# EAGLE design VF_OrdRes_PCB (EAGLE 9.6.2)
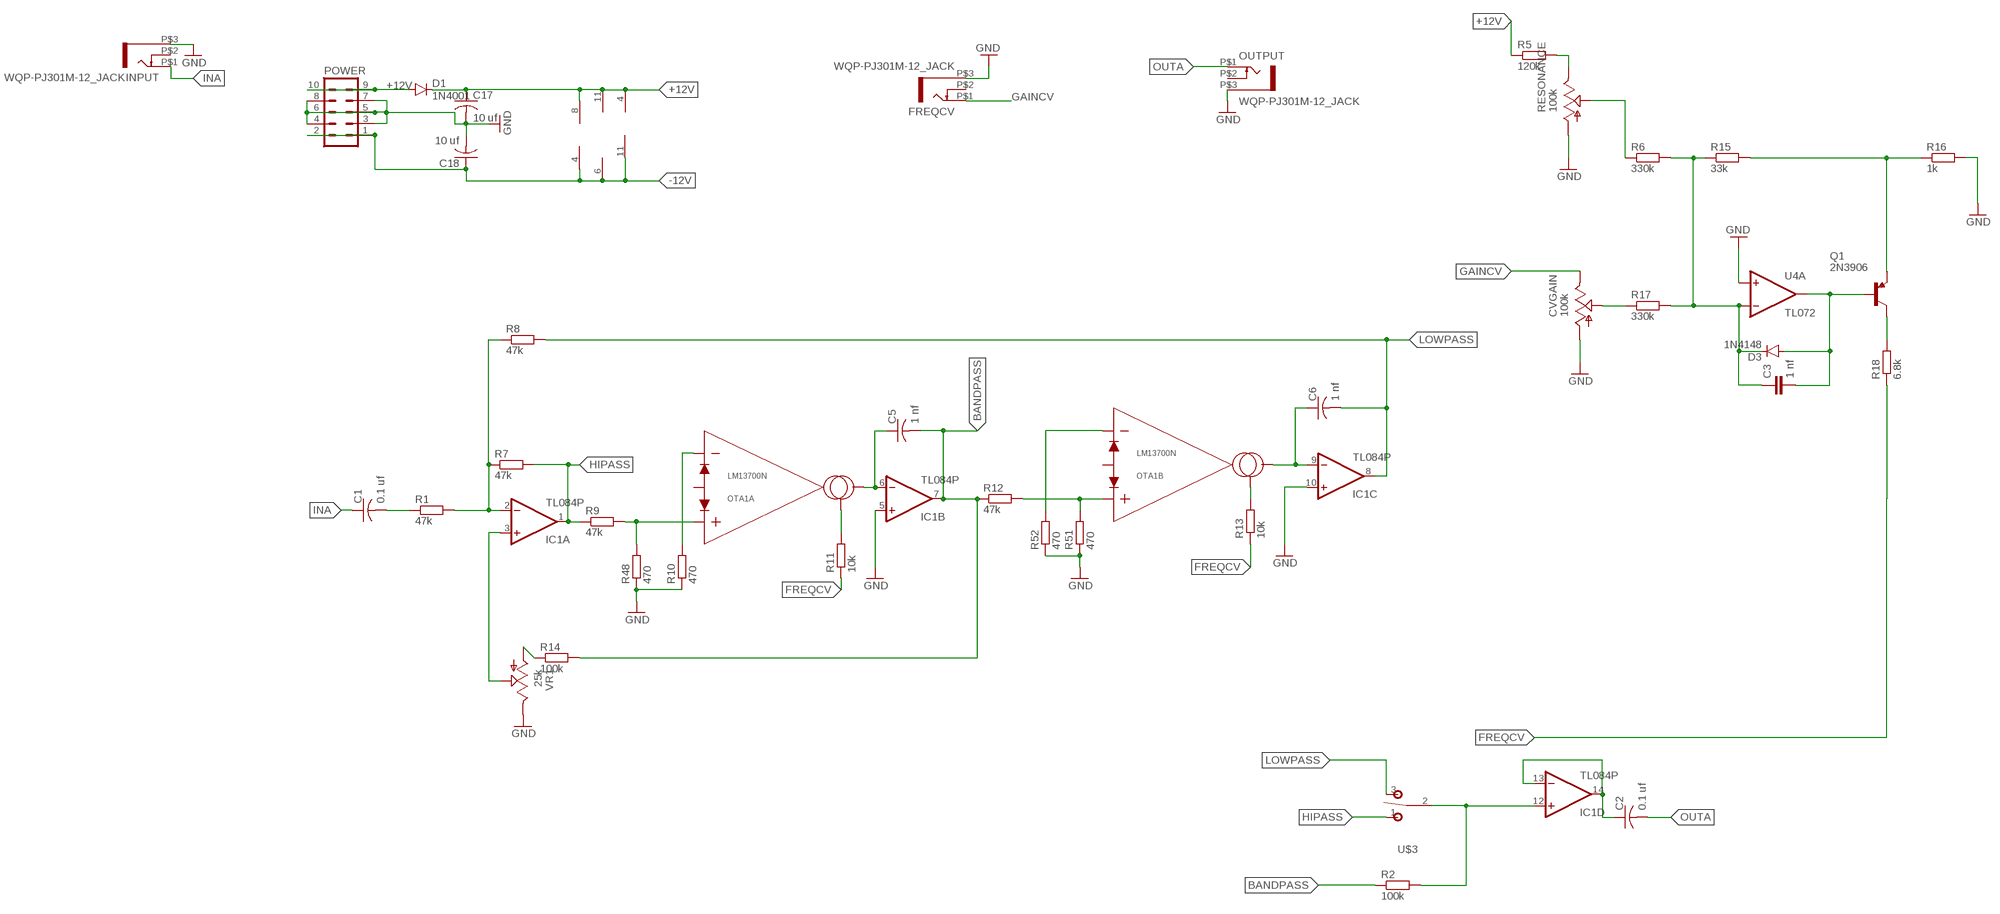
[diagram p0: schematic, sheet 1]

## Parts
C1  0.1 uf  C-US050-030X075  [C050-030X075]
C2  0.1 uf  C-US050-030X075  [C050-030X075]
C3  1 nf  C-EU050-025X075  [C050-025X075]
C5  1 nf  C-US050-030X075  [C050-030X075]
C6  1 nf  C-US050-030X075  [C050-030X075]
C17  10 uf  C-US050-030X075  [C050-030X075]
C18  10 uf  C-US050-030X075  [C050-030X075]
CVGAIN  100k  9MM_SNAP-IN_POT_  [9MM_SNAP-IN_POT]
D1  1N4001  1N4004  [DO41-10]
D3  1N4148  1N4148DO35-7  [DO35-7]
FREQCV  WQP-PJ301M-12_JACK  [WQP-PJ301M-12_JACK]
IC1  TL084P  [DIL14]
INPUT  WQP-PJ301M-12_JACK  [WQP-PJ301M-12_JACK]
OTA1  LM13700N  [DIP16]
OUTPUT  WQP-PJ301M-12_JACK  [WQP-PJ301M-12_JACK]
POWER  10_PIN_HEADER  [MA05-2]
Q1  2N3906  [TO92]
R1  47k  RESISTOR7MM  [7MM_RESISTOR]
R2  100k  RESISTOR7MM  [7MM_RESISTOR]
R5  120k  RESISTOR7MM  [7MM_RESISTOR]
R6  330k  RESISTOR7MM  [7MM_RESISTOR]
R7  47k  RESISTOR7MM  [7MM_RESISTOR]
R8  47k  RESISTOR7MM  [7MM_RESISTOR]
R9  47k  RESISTOR7MM  [7MM_RESISTOR]
R10  470  RESISTOR7MM  [7MM_RESISTOR]
R11  10k  RESISTOR7MM  [7MM_RESISTOR]
R12  47k  RESISTOR7MM  [7MM_RESISTOR]
R13  10k  RESISTOR7MM  [7MM_RESISTOR]
R14  100k  RESISTOR7MM  [7MM_RESISTOR]
R15  33k  RESISTOR7MM  [7MM_RESISTOR]
R16  1k  RESISTOR7MM  [7MM_RESISTOR]
R17  330k  RESISTOR7MM  [7MM_RESISTOR]
R18  6.8k  RESISTOR7MM  [7MM_RESISTOR]
R48  470  RESISTOR7MM  [7MM_RESISTOR]
R51  470  RESISTOR7MM  [7MM_RESISTOR]
R52  470  RESISTOR7MM  [7MM_RESISTOR]
RESONANCE  100k  9MM_SNAP-IN_POT_  [9MM_SNAP-IN_POT]
U4  TL072  [DIL08-SML]
U$3  T-80-T-SPDT-ON-OFF-ON  [M9040P]
VR1  25k  9MM_SNAP-IN_POT_  [9MM_SNAP-IN_POT]

## Nets
+12V [power]: C17.1 D1.C IC1.4(P:V+) OTA1.11(PWR:VCC) R5.1 U4.8(P:V+)
-12V [power]: C18.1 IC1.11(P:V-) OTA1.6(PWR:VEE) POWER.1 POWER.2 U4.4(P:V-)
BANDPASS: C5.2 IC1.7(B:OUT) R2.1 R12.1 R14.2
FREQCV: R11.1 R13.1 R18.1
GAINCV: CVGAIN.3(E) FREQCV.P$1
GND: C17.2 C18.2 CVGAIN.1(A) FREQCV.P$3 IC1.5(B:+IN) IC1.10(C:+IN) INPUT.P$3 OUTPUT.P$3 POWER.3 POWER.4 POWER.5 POWER.6 POWER.7 POWER.8 R10.1 R16.2 R48.1 R51.1 R52.1 RESONANCE.1(A) U4.3(A:+IN) VR1.3(E)
HIPASS: IC1.1(A:OUT) R7.2 R9.1 U$3.1(O)
INA: C1.1 INPUT.P$1
LOWPASS: C6.2 IC1.8(C:OUT) R8.2 U$3.3(S)
N$1: IC1.12(D:+IN) R2.2 U$3.2(P)
N$2: C1.2 R1.1
N$3: R5.2 RESONANCE.3(E)
N$4: C2.1 IC1.13(D:-IN) IC1.14(D:OUT)
N$5: IC1.2(A:-IN) R1.2 R7.1 R8.1
N$6: IC1.3(A:+IN) VR1.2(S)
N$7: R14.1 VR1.1(A)
N$8: OTA1.3(A:IN+) R9.2 R48.2
N$9: OTA1.4(A:IN-) R10.2
N$10: C5.1 IC1.6(B:-IN) OTA1.5(A:IOUT)
N$11: OTA1.1(A:IABC) R11.2
N$12: OTA1.14(B:IN+) R12.2 R51.2
N$13: OTA1.13(B:IN-) R52.2
N$14: OTA1.16(B:IABC) R13.2
N$15: C6.1 IC1.9(C:-IN) OTA1.12(B:IOUT)
N$16: C3.1 D3.C R6.2 R15.1 R17.2 U4.2(A:-IN)
N$17: Q1.3(E) R15.2 R16.1
N$18: R6.1 RESONANCE.2(S)
N$19: CVGAIN.2(S) R17.1
N$20: C3.2 D3.A Q1.2(B) U4.1(A:OUT)
N$21: Q1.1(C) R18.2
N$33: D1.A POWER.9 POWER.10
OUTA: C2.2 OUTPUT.P$1
Unconnected: FREQCV.P$2 INPUT.P$2 OTA1.2(A:BIAS) OTA1.7(BUFA:IN) OTA1.8(BUFA:OUT) OTA1.9(BUFB:OUT) OTA1.10(BUFB:IN) OTA1.15(B:BIAS) OUTPUT.P$2 U4.5(B:+IN) U4.6(B:-IN) U4.7(B:OUT)

## Library data of the parts
C1 C2 C5 C6 C17 C18 = rcl:C-US: CAPACITOR, American symbol; SPICEPREFIX: C
C3 = rcl:C-EU: CAPACITOR, European symbol; SPICEPREFIX: C
CVGAIN RESONANCE VR1 = MusicThingModular:9MM_SNAP-IN_POT: 9mm vertical snap-in pot, Alpha / Panasonic style
D1 = diode:1N4004: DIODE general purpose rectifier, 1 A
D3 = diode:1N4148: DIODE high speed (Philips)
FREQCV INPUT OUTPUT = thonkiconn:WQP-PJ301M-12_JACK
IC1 = linear:TL084: OP AMP
OTA1 = OTAs:LM13700: Dual OTA with linearizing diode and output buffers - 2MHz open-loop bandwidth - Linearizing diodes reduces distortion at higher differential input voltages - Darlington output buffers enables low-impedance output LM13700 or LM13600 The LM13700 differs from the LM13600 in that the 13700's output buffers are biased independently from the transconductance amplifier, allowing superior performance in audio applications. Originally released by National Semiconductor Manufactured by Texas Instruments.
POWER = TomW:10_PIN_HEADER: PIN HEADER; OC_FARNELL: unknown; OC_NEWARK: unknown
Q1 = transistor-pnp:2N3906: PNP Transistor
R1 R2 R5-R18 R48 R51 R52 = MusicThingModular:RESISTOR: Standard resistor, various versions
U4 = MusicThingModular:TL072: Generic Dual Op Amp
U$3 = MusicThingModular:T-80-T-SPDT-ON-OFF-ON

## Net classes
1 power: width 0.61 mm

## Board
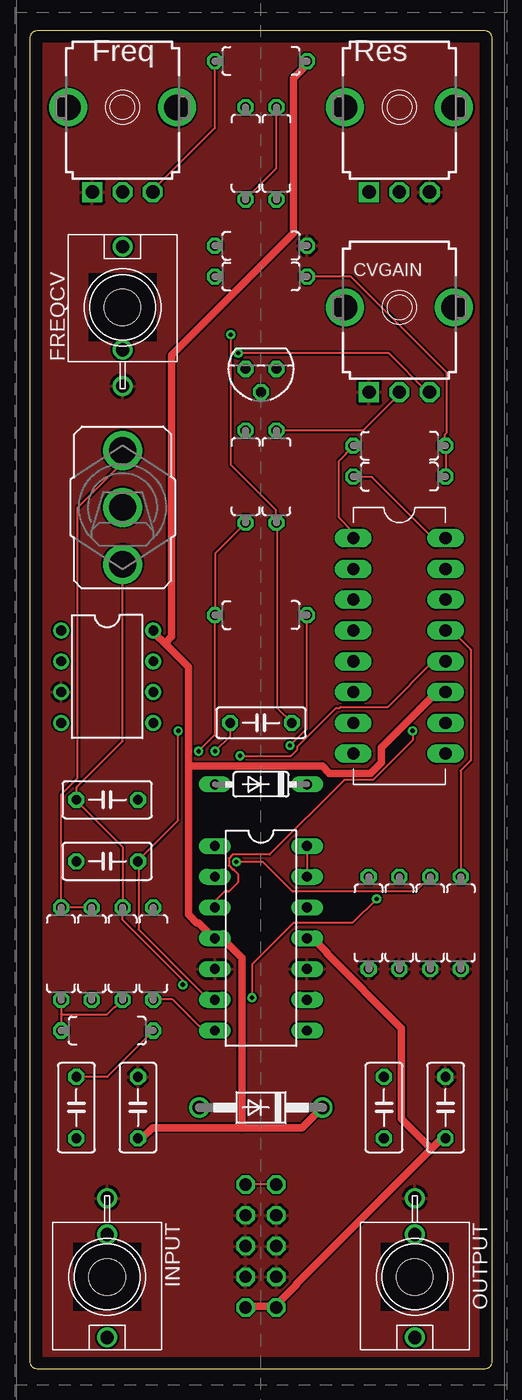
[diagram p1: board, top side]
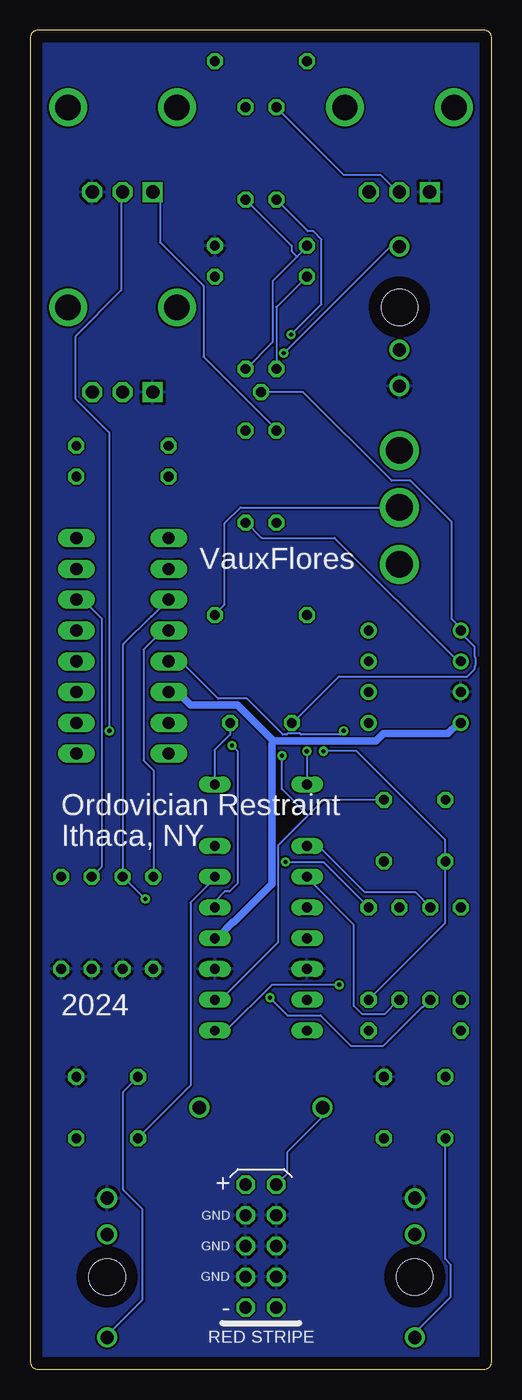
[diagram p2: board, bottom side, seen from below]

Size 38.1 x 110.49 mm. Coordinates in mm from the lower left corner, seen from the top.
Copper layers (1*16): Top 0.035mm / dielectric 1.5mm / Bottom 0.035mm
Design rules "default": minimum track width 6mil, minimum drill 0.35mm, track to track 6mil, track to pad 6mil, pad to pad 6mil, via to via 6mil, smd to smd 6mil, copper to edge 40mil, drill to drill 6mil, minimum pad ring 10mil, minimum via ring 8mil, stop-mask expansion 4mil, vias tented up to drill 0mil, thermal gap 10mil
Holes 3 mm at 7.62,87.63 6.35,7.62 31.75,7.62

### Footprints (pad centres in the part's own frame; a part is rotated, then mirrored left to right if it is on the bottom)
C050-030X075 = drill 0.813 octagon: 1 -2.54,0; 2 2.54,0
C050-025X075 = drill 0.813 octagon: 1 -2.54,0; 2 2.54,0
9MM_SNAP-IN_POT = drill 1.1 square: 1 -2.5,-7 | drill 1.1 octagon: 2 0,-7; 3 2.5,-7 | drill 2.1 pad 2.794: CHASSIS1 -4.5,0; CHASSIS2 4.5,0
DO41-10 = drill 1.118: A 5.08,0; C -5.08,0
DO35-7 = drill 0.813 long: A 3.81,0; C -3.81,0
WQP-PJ301M-12_JACK = drill 1.1: P$1 0,5; P$2 0,-3.5; P$3 0,-6.5
DIL14 = drill 0.813 long: 1 -7.62,-3.81; 2 -5.08,-3.81; 3 -2.54,-3.81; 4 0,-3.81; 5 2.54,-3.81; 6 5.08,-3.81; 7 7.62,-3.81; 8 7.62,3.81; 9 5.08,3.81; 10 2.54,3.81; 11 0,3.81; 12 -2.54,3.81; 13 -5.08,3.81; 14 -7.62,3.81
DIP16 = drill 1 long: 1 -3.81,0; 2 -3.81,-2.54; 3 -3.81,-5.08; 4 -3.81,-7.62; 5 -3.81,-10.16; 6 -3.81,-12.7; 7 -3.81,-15.24; 8 -3.81,-17.78; 9 3.81,-17.78; 10 3.81,-15.24; 11 3.81,-12.7; 12 3.81,-10.16; 13 3.81,-7.62; 14 3.81,-5.08; 15 3.81,-2.54; 16 3.81,0
MA05-2 = drill 1.016 octagon: 1 -5.08,-1.27; 2 -5.08,1.27; 3 -2.54,-1.27; 4 -2.54,1.27; 5 0,-1.27; 6 0,1.27; 7 2.54,-1.27; 8 2.54,1.27; 9 5.08,-1.27; 10 5.08,1.27
TO92 = drill 0.813 octagon: 1 1.27,0; 2 0,1.905; 3 -1.27,0
7MM_RESISTOR = drill 0.813 octagon: 1 -3.81,0; 2 3.81,0
DIL08-SML = drill 0.813 pad 1.27: 1 -3.81,-3.81; 2 -1.27,-3.81; 3 1.27,-3.81; 4 3.81,-3.81; 5 3.81,3.81; 6 1.27,3.81; 7 -1.27,3.81; 8 -3.81,3.81
M9040P = drill 2.2: 1 0,4.699 | drill 2.2 pad 3: 2 0,0; 3 0,-4.699

### Placement (x,y rotation side)
C1  3.81,21.59 90 top
C2  29.21,21.59 90 top
C3  19.05,53.34 180 top
C5  6.35,41.91 180 top
C6  6.35,46.99 180 top
C17  8.89,21.59 90 top
C18  34.29,21.59 90 top
CVGAIN  30.48,87.63 0 top
D1  19.05,21.59 180 top
D3  19.05,48.26 180 top
FREQCV  7.62,87.63 0 top
IC1  19.05,35.56 270 top
INPUT  6.35,7.62 180 top
OTA1  30.48,68.58 0 top
OUTPUT  31.75,7.62 180 top
POWER  19.05,10.16 90 bottom
Q1  19.05,82.55 180 top
R1  6.35,27.94 180 top
R2  19.05,62.23 0 top
R5  19.05,107.95 180 top
R6  17.78,100.33 270 top
R7  2.54,34.29 90 top
R8  7.62,34.29 90 top
R9  5.08,34.29 270 top
R10  27.94,36.83 90 top
R11  30.48,76.2 180 top
R12  10.16,34.29 90 top
R13  30.48,73.66 180 top
R14  17.78,73.66 270 top
R15  20.32,100.33 270 top
R16  19.05,92.71 0 top
R17  20.32,73.66 270 top
R18  19.05,90.17 180 top
R48  30.48,36.83 90 top
R51  33.02,36.83 90 top
R52  35.56,36.83 90 top
RESONANCE  7.62,104.14 0 top
U4  6.35,57.15 270 top
U$1  [EURO_PCB_8HP]  -1.27,-8.89 0 top  (outside the outline)
U$3  7.62,71.12 0 top
VR1  30.48,104.14 0 top

### Tracks (layer width: path | path; a pad name or v marks a point on that pad's centre or on a via)
+12V
  Top 0.61: 17.48,19.91 22.43,19.91 24.11,21.59 D1.C | 17.48,19.91 10.08,19.91 9.25,19.07 8.94,19.07 C17.1 | 17.48,19.91 17.48,33.93 15.88,35.53 15.27,35.53 IC1.4 15.04,35.69 13.89,36.83 13.74,36.83 13.06,37.52 13.06,49.78 | 11.11,59.88 13.06,57.94 13.06,49.78 | 11.11,59.88 10.31,60.68 10.31,60.76 10.16,60.91 U4.8 | 11.11,59.88 11.68,60.45 11.68,83.69 21.74,93.75 21.74,106.55 22.81,107.62 22.81,107.92 R5.1 | OTA1.11 33.55,55.88 28.98,51.31 28.98,50.09 28.07,49.17 24.71,49.17 24.11,49.78 13.06,49.78
-12V
  Top 0.61: 33.13,18.2 21.97,7.04 21.97,6.96 20.37,5.36 20.37,5.13 POWER.2 20.07,5.05 19.84,5.05 19.68,5.21 18.54,5.21 18.39,5.05 17.78,5.05 POWER.1 | 33.13,18.2 33.93,19 34.24,19 C18.1 | 33.13,18.2 30.66,20.68 30.66,28.14 24.49,34.31 24.49,34.39 23.34,35.53 22.89,35.53 IC1.11
  Bottom 0.61: 18.01,51.84 9.55,51.84 8.94,52.45 3.61,52.45 2.77,53.29 2.54,53.29 U4.4 | 18.01,51.84 20.98,54.81 24.87,54.81 25.93,55.88 OTA1.6 | IC1.11 22.81,35.61 22.66,35.61 21.36,36.91 21.29,36.91 18.16,40.03 18.16,51.61 18.01,51.84
BANDPASS  (via drill 0.35)
  Top 0.152: R14.2 17.78,69.83 15.27,67.31 15.27,62.28 R2.1 15.27,62.2 15.27,52.38 v13.89,51 | R12.1 10.16,30.51 11.76,30.51 14.28,27.99 15.19,27.99 IC1.7
  Bottom 0.152: R12.1 10.16,30.51 3.84,36.83 3.84,41.86 C5.2 3.84,41.94 3.84,43.69 11.15,51 v13.89,51
FREQCV
  Top 0.152: R13.1 34.31,73.71 34.31,76.15 R11.1 34.24,76.22 34.24,77.14 34.39,77.29 34.39,82.25 26.47,90.17 R18.1
GAINCV  (via drill 0.35)
  Top 0.152: v17.17,83.84 29.59,83.84 32.79,80.64 32.94,80.64 CVGAIN.3
  Bottom 0.152: v17.17,83.84 8.41,92.61 7.64,92.61 FREQCV.P$1
GND
  pour Top: -1.27,0 39.37,0 39.37,109.22 38.1,110.49 -1.27,110.49
  pour Bottom: -1.27,0 39.37,0 39.37,111.76 -1.27,111.76
HIPASS
  Top 0.152: 2.54,38.12 5.05,38.12 R9.1 | 2.54,38.12 2.54,47.42 3.91,48.79 3.91,71.12 7.57,74.78 7.57,75.77 U$3.1 | 2.54,38.12 R7.2
  Bottom 0.152: IC1.1 15.19,43.16 14.28,43.16 10.46,39.34 6.27,39.34 5.05,38.12 R9.1
INA
  Bottom 0.152: INPUT.P$1 6.35,3 3.38,5.97 3.38,8.64 3.84,9.09 3.84,19 C1.1
LOWPASS  (via drill 0.35)
  Top 0.152: v12.6,31.73 12.6,32.11 7.57,37.13 7.57,38.05 R8.2 7.64,38.12 7.64,43.08 3.76,46.96 C6.2 3.84,47.04 3.84,48.03 7.64,51.84 7.64,66.4 U$3.3
  Bottom 0.152: v12.6,31.73 18.16,31.73 21.89,27.99 22.81,27.99 IC1.8
N$1  (via drill 0.35)
  Top 0.152: v21.44,51.46 22.81,52.83 22.81,62.2 R2.2
  Bottom 0.152: v21.44,51.46 20.98,51 20.98,40.11 21.67,39.42 22.05,39.42 22.81,38.66 22.81,38.12 IC1.12 | U$3.2 20.75,71.12 22.05,69.83 22.05,63.12 22.89,62.28 R2.2
N$2
  Top 0.152: C1.2 3.84,24.1 6.35,24.1 10.16,27.91 R1.1
N$3
  Top 0.152: R5.2 15.27,107.92 15.27,102.44 10.16,97.33 10.16,97.18 RESONANCE.3
N$4
  Top 0.152: IC1.14 22.89,43.16 22.89,40.64 IC1.13
  Bottom 0.152: C2.1 29.21,19.07 24.87,23.42 24.87,38.51 22.89,40.49 22.89,40.64 IC1.13
N$5
  Top 0.152: R7.1 2.54,29.29 | 2.54,29.29 R1.2 | R8.1 7.04,29.9 6.96,29.9 6.35,29.29 2.54,29.29
  Bottom 0.152: IC1.2 15.19,40.64 15.19,40.49 11.38,36.68 11.38,29.97 10.69,29.29 8.87,29.29 7.64,30.51 R8.1
N$6  (via drill 0.35)
  Top 0.152: v31.57,52.68 31.57,51.92 28.3,48.64 25.93,48.64 19.76,42.47 16.71,42.47 16.41,42.16 16.41,41.55 16.71,41.25 16.79,41.25 17.17,40.87 17.17,40.18 16.41,39.42 16.03,39.42 15.27,38.66 15.27,38.12 IC1.3
  Bottom 0.152: v31.57,52.68 31.57,77.29 34.39,80.11 34.39,85.22 30.58,89.03 30.58,97.03 30.5,97.1 VR1.2
N$7
  Bottom 0.152: R14.1 17.78,77.52 23.8,83.54 23.8,89.41 27.38,92.99 27.38,96.57 27.91,97.1 VR1.1
N$8  (via drill 0.35)
  Top 0.152: v18.31,30.66 18.31,33.4 21.74,36.83 26.62,36.83 v28.6,38.81
  Bottom 0.152: R9.2 5.66,29.9 5.74,29.9 8.94,26.7 11.61,26.7 14.12,29.21 16.87,29.21 v18.31,30.66 | 30.43,40.64 v28.6,38.81 | 30.43,40.64 30.43,59.84 28.14,62.13 28.07,62.13 26.7,63.5 OTA1.3 | 30.43,40.64 R48.2
N$9
  Bottom 0.152: R10.2 27.91,40.64 27.91,49.4 28.75,50.24 28.75,59.39 27.23,60.91 26.7,60.91 OTA1.4
N$10  (via drill 0.35)
  Top 0.152: IC1.6 15.19,30.51 14.73,30.51 8.94,36.3 8.94,41.86 C5.1 8.87,41.94 12.22,45.29 v12.22,52.68
  Bottom 0.152: v12.22,52.68 12.52,52.38 15.72,52.38 15.8,52.45 16.87,52.45 16.94,52.38 17.25,52.38 20.22,55.35 22.58,55.35 25.63,58.39 26.62,58.39 OTA1.5
N$11
  Top 0.152: R11.2 26.09,75.62 26.09,75.54 25.48,74.93 25.48,70.28 26.62,69.14 26.62,68.61 OTA1.1
N$12  (via drill 0.35)
  Top 0.152: v17.02,41.86 19.23,41.86 21.67,39.42 31.8,39.42 R51.2
  Bottom 0.152: v17.02,41.86 13.89,41.86 10.16,38.12 R12.2 | OTA1.14 33.78,63.5 32.18,61.9 32.18,41.48 R51.2
N$13
  Top 0.152: R52.2 35.53,40.64 35.53,49.4 36.37,50.24 36.37,59.39 34.85,60.91 34.31,60.91 OTA1.13
N$14
  Top 0.152: R13.2 26.7,73.64 28.22,73.64 33.25,68.61 34.24,68.61 OTA1.16
N$15  (via drill 0.35)
  Top 0.152: v17.32,50.62 21.51,50.62 22.05,51.16 22.05,51.38 25.25,54.59 25.55,54.59 25.63,54.66 29.52,54.66 33.25,58.39 34.24,58.39 OTA1.12
  Bottom 0.152: 15.15,45.71 13.89,46.96 8.94,46.96 C6.1 | 15.15,45.71 17.63,43.23 17.63,35.23 22.35,30.51 22.81,30.51 IC1.9 | v17.32,50.62 17.32,47.88 15.15,45.71
N$16  (via drill 0.35)
  Top 0.152: R6.2 17.78,96.57 20.3,99.08 20.3,104.11 R15.1 | C3.1 21.59,53.37 20.37,54.59 20.37,69.83 R17.2 20.3,69.9 20.3,70.89 16.56,74.62 v16.56,85.37
  Bottom 0.152: C3.1 21.59,52.38 22.89,51.08 22.89,48.26 D3.C | U4.2 2.54,58.47 2.85,58.47 12.98,68.61 19,68.61 20.3,69.9 R17.2 | v16.56,85.37 14.05,87.88 14.05,93.22 14.73,93.9 15.19,93.9 17.78,96.5 R6.2
N$17
  Bottom 0.152: 16.07,91.81 15.19,92.69 R16.1 | 16.07,91.81 18.09,89.79 18.09,84.76 20.3,82.55 Q1.3 | R15.2 16.48,92.69 16.48,92.23 16.07,91.81
N$18
  Bottom 0.152: R6.1 17.78,104.11 12.22,98.55 9.17,98.55 7.8,97.18 7.64,97.18 RESONANCE.2
N$19
  Top 0.152: R17.1 20.37,77.44 27.46,77.44 30.43,80.42 30.43,80.57 CVGAIN.2
N$20  (via drill 0.35)
  Top 0.152: v15.27,51 16.48,52.22 16.48,53.29 C3.2
  Bottom 0.152: C3.2 16.48,53.29 12.6,57.17 2.01,57.17 1.4,57.78 1.4,58.01 1.32,58.09 1.32,58.7 1.4,58.78 1.4,59.61 2.54,60.76 U4.1 2.54,61.14 3.3,61.9 3.3,69.9 6.73,73.33 8.26,73.33 15.57,80.64 Q1.2 | v15.27,51 15.27,48.26 D3.A
N$21
  Bottom 0.152: Q1.1 17.78,87.66 15.27,90.17 R18.2
N$33
  Top 0.152: POWER.9 17.78,15.27 20.3,15.27 POWER.10
  Bottom 0.152: D1.A 13.97,20.83 16.87,17.93 16.87,16.18 17.78,15.27 POWER.9
OUTA
  Bottom 0.152: C2.2 29.21,24.1 30.43,22.88 30.43,14.81 28.83,13.21 28.83,5.74 31.72,2.84 31.72,2.69 OUTPUT.P$1

### Text on the board
tNames: Freq | Res
bNames: VauxFlores | Ordovician Restraint | Ithaca, NY | 2024